# EAGLE design sx-lok-dec2-328 (EAGLE 7.5.0)
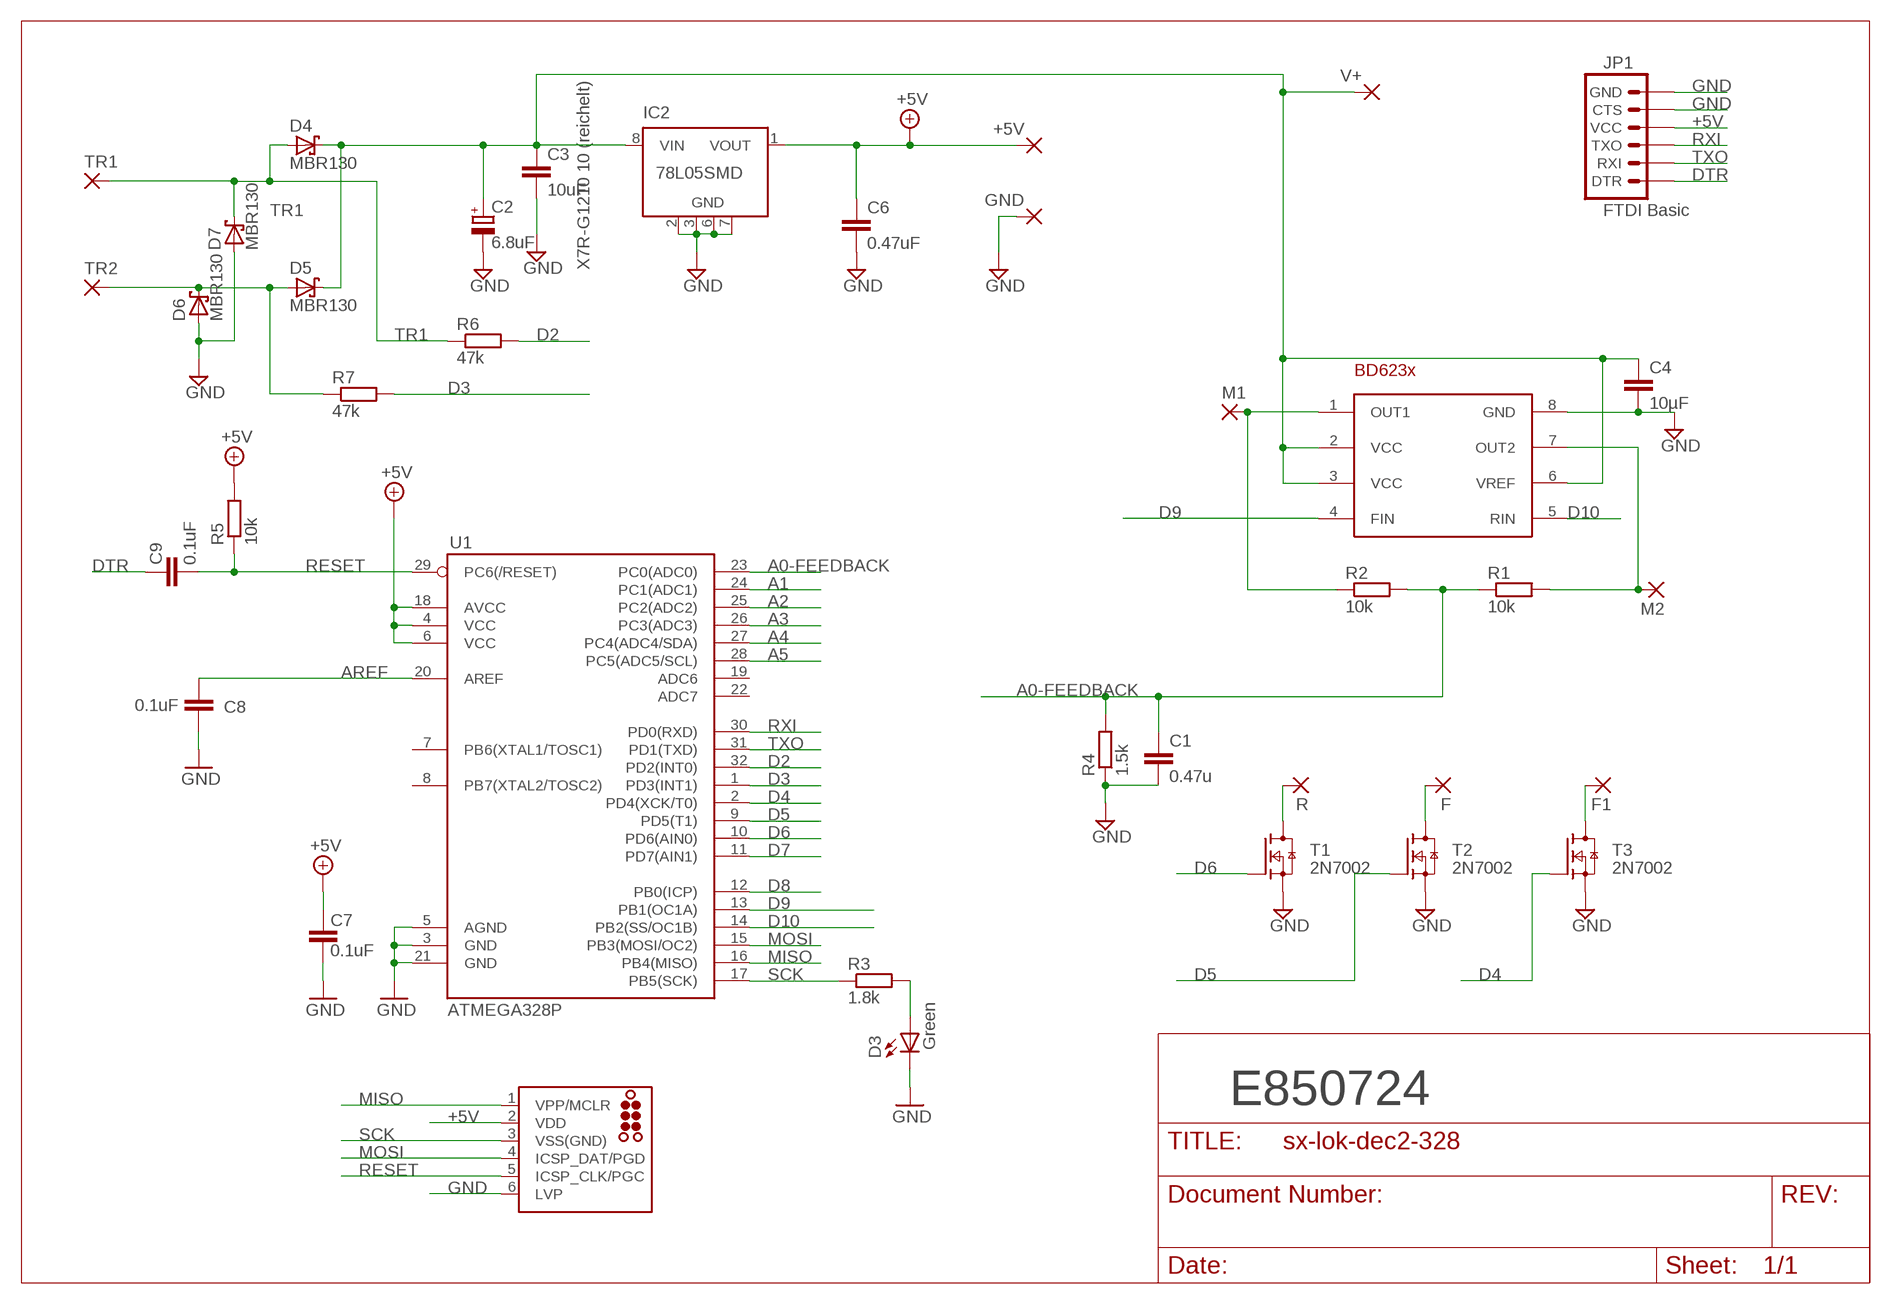
[diagram p0: schematic, sheet 1]

## Parts
+5V  SMD2  [SMD1,27-2,54]
BD6231  BD6231F  [SOP8]
C1  0.47u  C-EUC1206  [C1206]
C2  6.8uF  CPOL-EUSMCD  [SMC_D]
C3  10uF  C-EUC0805K  [C0805K]
C4  10µF  C-EUC1210K  [C1210K]
C6  0.47uF  C-EUC1206  [C1206]
C7  0.1uF  CAP0805  [0805]
C8  0.1uF  CAP0805  [0805]
C9  0.1uF  CAP0805  [0805]
D3  Green  LED0603  [LED-0603]
D4  MBR130  BAS116H  [SOD123F]
D5  MBR130  BAS116H  [SOD123F]
D6  MBR130  BAS116H  [SOD123F]
D7  MBR130  BAS116H  [SOD123F]
F  SMD2  [SMD1,27-2,54]
F1  SMD2  [SMD1,27-2,54]
GND  SMD2  [SMD1,27-2,54]
IC2  78L05SMD  [SO08]
J1  ISP  TC2030-MCP-NL  [TC2030-MCP-NL]
JP1  FTDI Basic  ARDUINO_SERIAL_PROGRAMPTH  [1X06]
M1  SMD2  [SMD1,27-2,54]
M2  SMD2  [SMD1,27-2,54]
R  SMD2  [SMD1,27-2,54]
R1  10k  R-EU_R0805  [R0805]
R2  10k  R-EU_R0805  [R0805]
R3  1.8k  R-EU_M0805  [M0805]
R4  1.5k  R-EU_R0805  [R0805]
R5  10k  R-EU_M0805  [M0805]
R6  47k  R-EU_R0805  [R0805]
R7  47k  R-EU_M0805  [M0805]
T1  2N7002  2N7002E  [SOT23]
T2  2N7002  2N7002E  [SOT23]
T3  2N7002  2N7002E  [SOT23]
TR1  SMD2  [SMD1,27-2,54]
TR2  SMD2  [SMD1,27-2,54]
U1  ATMEGA328P  ATMEGA168  [TQFP32-08]
V+  SMD2  [SMD1,27-2,54]

## Nets
+5V: +5V.1(P) C6.1 C7.2 IC2.1(VOUT) J1.2(VDD) JP1.4(VCC) R5.2 U1.4(VCC) U1.6(VCC) U1.18(AVCC)
+20V: BD6231.2(VCC) BD6231.3(VCC) BD6231.6(VREF) C2.+ C3.1 C4.1 D4.1(K) D5.1(K) IC2.8(VIN) V+.1(P)
A0-FEEDBACK: C1.1 R1.1 R2.2 R4.2 U1.23(PC0(ADC0))
A1: U1.24(PC1(ADC1))
A2: U1.25(PC2(ADC2))
A3: U1.26(PC3(ADC3))
A4: U1.27(PC4(ADC4/SDA))
A5: U1.28(PC5(ADC5/SCL))
AREF: C8.2 U1.20(AREF)
D2: R6.2 U1.32(PD2(INT0))
D3: R7.2 U1.1(PD3(INT1))
D4: T3.1(G) U1.2(PD4(XCK/T0))
D5: T2.1(G) U1.9(PD5(T1))
D6: T1.1(G) U1.10(PD6(AIN0))
D7: U1.11(PD7(AIN1))
D8: U1.12(PB0(ICP))
D9: BD6231.4(FIN) U1.13(PB1(OC1A))
D10: BD6231.5(RIN) U1.14(PB2(SS/OC1B))
DTR: C9.2 JP1.1(DTR)
GND: BD6231.8(GND) C1.2 C2.- C3.2 C4.2 C6.2 C7.1 C8.1 D3.C D6.2(A) D7.2(A) GND.1(P) IC2.2(GND) IC2.3(GND) IC2.6(GND) IC2.7(GND) J1.6(LVP) JP1.5(CTS) JP1.6(GND) R4.1 T1.2(S) T2.2(S) T3.2(S) U1.3(GND) U1.5(AGND) U1.21(GND)
MISO: J1.1(VPP/MCLR) U1.16(PB4(MISO))
MOSI: J1.4(ICSP_DAT/PGD) U1.15(PB3(MOSI/OC2))
MOTOR1: BD6231.1(OUT1) M1.1(P) R2.1
MOTOR2: BD6231.7(OUT2) M2.1(P) R1.2
N$1: D3.A R3.2
N$2: R.1(P) T1.3(D)
N$3: F.1(P) T2.3(D)
N$4: F1.1(P) T3.3(D)
RESET: C9.1 J1.5(ICSP_CLK/PGC) R5.1 U1.29(PC6(/RESET))
RXI: JP1.3(TXO) U1.30(PD0(RXD))
SCK: J1.3(VSS(GND)) R3.1 U1.17(PB5(SCK))
TR1: D4.2(A) D7.1(K) R6.1 TR1.1(P)
TR-L1: D5.2(A) D6.1(K) R7.1 TR2.1(P)
TXO: JP1.2(RXI) U1.31(PD1(TXD))
Unconnected: IC2.4(NC) IC2.5(NC) U1.7(PB6(XTAL1/TOSC1)) U1.8(PB7(XTAL2/TOSC2)) U1.19(ADC6) U1.22(ADC7)

## Notes on the sheet
- X7R-G1210 10 (reichelt)
- E850724

## Library data of the parts
+5V F F1 GND M1 M2 R TR1 TR2 V+ = wirepad:SMD2: SMD PAD
BD6231 = bd6231f:BD6231F: H-Bridge Driver - Rohm - BD622x and BD623x
C1 C3 C4 C6 = rcl:C-EU: CAPACITOR, European symbol
C2 = rcl:CPOL-EU: POLARIZED CAPACITOR, European symbol
C7-C9 = SparkFun:CAP: Capacitor Standard 0603 ceramic capacitor, and 0.1" leaded capacitor.
D3 = SparkFun:LED: LEDs Standard schematic elements and footprints for 5mm, 3mm, 1206, and 0603 sized LEDs. 5mm - Spark Fun Electronics SKU : COM-00529 (and others)
D4-D7 = NXP_60_26022015:BAS116H: Low leakage switching diode Low leakage switching diode, encapsulated in a SOD123F small and flat lead Surface-Mounted Device (SMD) plastic package. AAL Eindhoven MK
IC2 = linear:78L*SMD: Positive VOLTAGE REGULATOR
J1 = tag-connect:TC2030: TAG-CONNECT ICSP Connector Manufacturer: Tag-Connect <http://www.tag-connect.com> Cable for easy In-Circuit Serial Programming. Designed for Microchip ICD2, suitable for many others. Two variants - one "with legs" (for hands-free fit on PCB) and another "without legs" for quick programming. PAD Description 1 MCLR/Vpp 2 Vdd 3 GND 4 PGD (ISPDAT) 5 PGC (ISPCLK) 6 nc (used for LVP) ©2009 ROFA.cz - modified and updated by Robert Darlington ‹rdarlington@gmail.com›
JP1 = SparkFun:ARDUINO_SERIAL_PROGRAM
R1-R7 = rcl:R-EU_: RESISTOR, European symbol
T1-T3 = NXP_60_26022015:2N7002: N-channel TrenchMOS FET N-channel enhancement mode Field-Effect Transistor (FET) in a plastic package using TrenchMOS technology. AAL Eindhoven MK
U1 = SparkFun:ATMEGA168

## Net classes
0 default: width 0.203 mm
1 vcc: width 0.254 mm

## Board
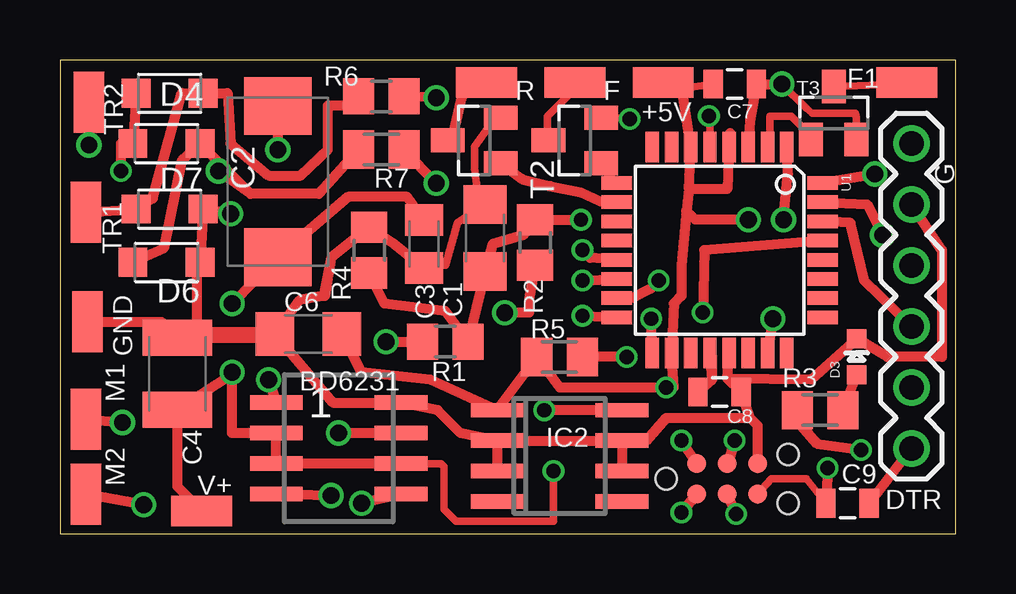
[diagram p1: board, top side]
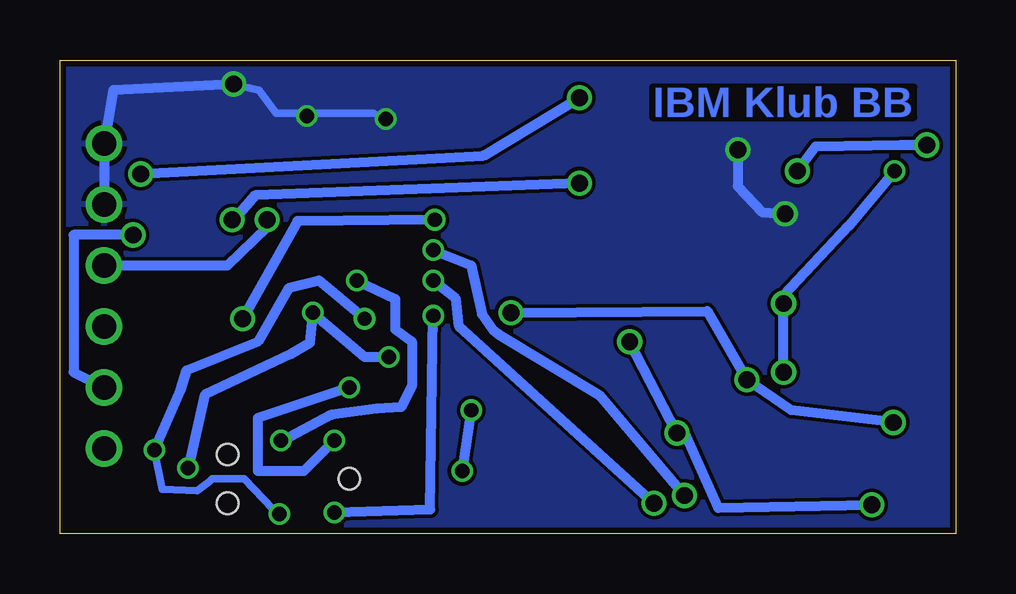
[diagram p2: board, bottom side, seen from below]

Size 37.34 x 19.74 mm. Coordinates in mm from the lower left corner, seen from the top.
Outline: 0,0 37.34,0 37.34,19.74 0,19.74 0,0
Copper layers (1*16): Top 0.018mm / dielectric 1.55mm / Bottom 0.018mm
Design rules "eC_2Layer_PClass6_BaseCopperO18_eCDefault": minimum track width 0.15mm, minimum drill 0.35mm, track to track 0.15mm, track to pad 0.15mm, pad to pad 0.15mm, via to via 0.15mm, smd to smd 0mil, copper to edge 0.25mm, drill to drill 0.35mm, minimum pad ring 0.175mm, minimum via ring 0.125mm, stop-mask expansion 0mil, vias tented up to drill 0.45mm, thermal gap 0.2mm

### Footprints (pad centres in the part's own frame; a part is rotated, then mirrored left to right if it is on the bottom)
SMD1,27-2,54 = smd 1.27 x 2.54: 1 0,0
SOP8 = smd 0.6 x 2.2: 1 -1.905,-2.6; 2 -0.635,-2.6; 3 0.635,-2.6; 4 1.905,-2.6; 5 1.905,2.6; 6 0.635,2.6; 7 -0.635,2.6; 8 -1.905,2.6
C1206 = smd 1.6 x 1.8: 1 -1.4,0; 2 1.4,0
SMC_D = smd 2.4 x 2.8: + -3.15,0; - 3.15,0
C0805K = smd 1.3 x 1.6: 1 -1,0; 2 1,0
C1210K = smd 1.5 x 2.9: 1 -1.5,0; 2 1.5,0
0805 = smd 0.8 x 1.2: 1 -0.9,0; 2 0.9,0
LED-0603 = smd 0.8 x 0.8: A 0,-0.75; C 0,0.75
SOD123F = smd 1.2 x 1.2: 1 -1.4,0; 2 1.4,0
SO08 = smd 0.6 x 2.2: 1 -1.905,-2.6; 2 -0.635,-2.6; 3 0.635,-2.6; 4 1.905,-2.6; 5 1.905,2.6; 6 0.635,2.6; 7 -0.635,2.6; 8 -1.905,2.6
TC2030-MCP-NL = smd 0.787 x 0.787: 1 1.27,-0.635; 2 1.27,0.635; 3 2.54,-0.635; 4 2.54,0.635; 5 3.81,-0.635; 6 3.81,0.635 | hole 0.889: 0,0; 5.08,-1.016; 5.08,1.016
1X06 = drill 1.016: 1 0,0; 2 2.54,0; 3 5.08,0; 4 7.62,0; 5 10.16,0; 6 12.7,0
R0805 = smd 1.3 x 1.5: 1 -0.95,0; 2 0.95,0
M0805 = smd 1.3 x 1.6: 1 -0.95,0; 2 0.95,0
SOT23 = smd 1 x 1.4: 1 -0.95,-1.1; 2 0.95,-1.1; 3 0,1.1
TQFP32-08 = smd 1.27 x 0.559: 1 -4.293,2.8; 2 -4.293,2; 3 -4.293,1.2; 4 -4.293,0.4; 5 -4.293,-0.4; 6 -4.293,-1.2; 7 -4.293,-2; 8 -4.293,-2.8; 17 4.293,-2.8; 18 4.293,-2; 19 4.293,-1.2; 20 4.293,-0.4; 21 4.293,0.4; 22 4.293,1.2; 23 4.293,2; 24 4.293,2.8 | smd 0.559 x 1.27: 9 -2.8,-4.293; 10 -2,-4.293; 11 -1.2,-4.293; 12 -0.4,-4.293; 13 0.4,-4.293; 14 1.2,-4.293; 15 2,-4.293; 16 2.8,-4.293; 25 2.8,4.293; 26 2,4.293; 27 1.2,4.293; 28 0.4,4.293; 29 -0.4,4.293; 30 -1.2,4.293; 31 -2,4.293; 32 -2.8,4.293

### Placement (x,y rotation side)
+5V  25.15,18.8 90 top
BD6231  11.62,3.56 270 top
C1  17.72,12.32 90 top
C2  9.08,14.67 90 top
C3  15.18,12.06 270 top
C4  4.89,6.67 90 top
C6  10.35,8.32 180 top
C7  28.13,18.73 180 top
C8  27.5,5.91 180 top
C9  32.83,1.27 0 top
D3  33.21,7.37 0 top
D4  4.57,18.35 0 top
D5  4.45,16.26 0 top
D6  4.45,11.3 0 top
D7  4.57,13.53 0 top
F  21.46,18.8 90 top
F1  35.31,18.8 90 top
GND  1.14,8.83 180 top
IC2  20.83,3.24 270 top
J1  25.27,2.29 0 top
JP1  35.5,3.56 90 top
M1  1.08,4.76 0 top
M2  1.08,1.65 0 top
R  17.78,18.8 90 top
R1  16.07,8 180 top
R2  19.81,12.13 90 top
R3  31.69,5.14 0 top
R4  12.89,11.81 270 top
R5  20.83,7.37 180 top
R6  13.4,18.22 0 top
R7  13.4,16 0 top
T1  17.27,16.38 90 top
T2  21.46,16.38 90 top
T3  32.26,17.53 0 top
TR1  1.08,13.4 180 top
TR2  1.21,17.97 180 top
U1  27.5,11.81 270 top
V+  5.91,0.95 270 top

### Tracks (layer width: path | path; a pad name or v marks a point on that pad's centre or on a via)
+5V  (via drill 0.6, 0.7)
  Top 0.305: C7.2 26.29,18.61 25.97,18.29
  Top 0.406: 26.23,14.35 27.81,14.35 U1.4 27.81,16.1 27.94,16.7 | 26.23,14.35 U1.6 25.97,18.29 +5V.1 | 26.23,14.35 26.11,13.45 | 26.11,13.45 25.91,11.18 25.91,9.91 25.59,9.59 U1.18 25.59,6.1 v25.27,6.1 20.83,6.1 R5.2 IC2.1 15.43,6.41 12.57,6.73 C6.1 | J1.2 v25.91,3.87 | v28.7,13.08 26.48,13.08 26.11,13.45
  Bottom 0.406: v25.91,3.87 27.18,2.6 29.08,2.6 29.08,4.83 v25.27,6.1 | JP1.4 30.35,11.18 28.7,12.76 v28.7,13.08
+20V  (via drill 0.6, 0.7)
  Top 0.305: BD6231.6 15.88,2.92 16,2.79 16,1.02 16.51,0.51 20.57,0.51 v20.57,2.6
  Top 0.406: C3.1 14.48,14.03 12,14.03 C2.+ v7.18,9.59 | BD6231.6 BD6231.3 BD6231.2 7.18,4.19 v7.18,6.73 7.18,6.64 C4.1 4.89,1.97 V+.1 | IC2.8 v20.19,5.14 | D4.1 D5.1 2.54,16.26 v2.54,15.11
  Bottom 0.406: v7.18,6.73 v7.18,9.59 7.18,9.91 4.45,12.83 v2.54,15.11 | v20.19,5.14 v20.57,2.6
A0-FEEDBACK  (via drill 0.6, 0.7)
  Top 0.406: R4.2 13.53,9.59 16.07,9.27 R1.1 C1.1 18.03,12.06 19.3,12.44 R2.2 v21.72,13.08 | v29.72,8.95 U1.23
  Bottom 0.406: v21.72,13.08 27.43,13.02 v29.72,8.95
AREF
  Top 0.406: U1.20 27.18,6.41 | 27.18,7.37 27.18,6.41 | 27.18,6.41 C8.2
D2  (via drill 0.7)
  Top 0.406: U1.32 v33.97,14.99 | v15.68,18.16 R6.2
  Bottom 0.406: v33.97,14.99 19.68,15.75 v15.68,18.16
D3  (via drill 0.7)
  Top 0.406: R7.2 v15.68,14.61 | v30.16,13.08 30.35,14.99 U1.1
  Bottom 0.406: v15.68,14.61 29.21,14.1 29.97,13.21 v30.16,13.08
D4
  Top 0.305: T3.1 31.31,16.57 30.48,17.4 29.59,17.4 29.59,16.2 U1.2
D5
  Top 0.305: T2.1 22.56,15.25 U1.9
D6
  Top 0.406: T1.1 19.26,14.78 20.45,14.48 21.72,14.22 22.54,13.84 U1.10
D9  (via drill 0.6, 0.7)
  Top 0.406: U1.13 22.1,11.49 21.84,11.68 v21.78,11.81 | v11.3,1.59 BD6231.4
  Bottom 0.406: v21.78,11.81 20.19,11.18 19.75,9.14 19.3,8.51 19.05,8.32 14.86,5.78 v11.3,1.59
D10  (via drill 0.6, 0.7)
  Top 0.406: BD6231.5 v12.57,1.27 | v21.78,10.54 U1.14
  Bottom 0.406: v12.57,1.27 20.7,8.64 20.83,9.78 v21.78,10.54
DTR
  Top 0.406: JP1.1 C9.2
GND  (via drill 0.6, 0.7)
  Top 0.305: C3.2 16.07,11.18 16.57,12.95 C1.2 17.59,13.97 17.4,14.22 17.27,15.24 17.27,16.13 17.97,17.08 T1.2 | T2.2 23.18,17.33 v23.75,17.27 | U1.5 27.1,17.1 v27.05,17.4 | T3.2 33.21,17.34 33.15,17.53 31.37,17.53 31.12,17.72 v30.1,18.73
  Top 0.406: C6.2 11.37,5.46 BD6231.8 | 14.8,5.46 BD6231.8 | IC2.2 IC2.3 | IC2.2 IC2.7 | IC2.7 IC2.6 | IC2.7 24.45,3.87 25.27,4.83 28.77,4.83 | 28.77,4.83 C8.1 27.83,6.45 | 27.83,6.45 U1.21 | 28.77,4.83 29.08,4.51 J1.6 | JP1.5 36.77,11.81 36.77,7.37 34.48,7.37 D3.C 31.31,6.41 27.83,6.45 | U1.3 28.77,17.21 C7.1 v30.1,18.73 | C3.2 13.84,12.13 R4.1 11.3,11.49 | 11.3,11.49 10.99,9.91 9.97,9.72 | 9.97,9.72 C6.2 | C2.- v9.08,16 | v7.11,13.34 D7.2 D6.2 5.71,11.17 5.71,8.25 5.84,8.38 9.02,8.38 9.97,9.72 | IC2.2 16.7,4.19 15.75,5.14 BD6231.8 | GND.1 4.23,8.83 C4.2 8.8,8.17 C6.2 | 11.3,11.49 11.18,10.79 11.05,9.91 10.29,9.78 9.97,9.72
  Bottom 0.305: v23.75,17.27 24.26,17.53 27.05,17.53 | 27.05,17.53 28.33,17.53 29.03,18.48 v30.1,18.73 | v27.05,17.4 27.05,17.53
  Bottom 0.406: JP1.5 JP1.6 35.12,18.48 v30.1,18.73 | v9.08,16 9.08,14.48 8.07,13.4 v7.11,13.34
  pour Bottom: 0.06,19.68 37.27,19.68 37.4,0 0.06,0
MISO  (via drill 0.6)
  Top 0.406: J1.1 v25.91,0.89 | v21.78,9.08 U1.16
  Bottom 0.406: v25.91,0.89 21.91,1.02 v21.78,9.08
MOSI  (via drill 0.6)
  Top 0.406: U1.15 23.81,9.81 24.64,10.22 v24.96,10.54 | v28.13,3.87 J1.4
  Bottom 0.406: v24.96,10.54 23.37,9.78 23.37,8.51 22.67,8 22.67,6.16 23.11,5.27 24.13,5.21 26.04,4.95 28.07,3.87 v28.13,3.87
MOTOR1  (via drill 0.7)
  Top 0.406: M1.1 v2.6,4.64 | v8.7,6.41 BD6231.1 | R2.1 19.56,9.78 19.56,9.21 v18.54,9.21
  Bottom 0.406: v2.6,4.64 6.86,5.14 v8.7,6.41 10.35,9.27 v18.54,9.21
MOTOR2  (via drill 0.7)
  Top 0.406: BD6231.7 v11.62,4.19 | v13.59,8 R1.2 | v3.49,1.21 M2.1
  Bottom 0.406: v13.59,8 v11.62,4.19 11.24,4.06 9.91,1.08 v3.49,1.21
N$1
  Top 0.406: R3.2 D3.A
N$2
  Top 0.406: R.1 18.71,18.8 16.76,18.29 16.26,16.13 T1.3
N$3
  Top 0.305: F.1 21.46,18.54 20.32,17.4 20.32,16.43 T2.3
N$4
  Top 0.305: T3.3 35.22,18.75 F1.1
RESET  (via drill 0.6)
  Top 0.305: C9.1 31.12,2.29 29.65,2.29 J1.5
  Top 0.406: U1.29 26.86,11.81 v26.8,9.21 | v23.62,7.37 R5.1 | v32,2.73 C9.1
  Bottom 0.406: v23.62,7.37 24.64,7.37 v26.8,9.21 26.92,7.94 27.69,7.49 31.31,5.78 v32,2.73
RXI
  Top 0.406: JP1.3 33.53,10.54 32.96,12.95 U1.30
SCK  (via drill 0.6)
  Top 0.406: R3.1 30.35,5.14 31.56,3.75 v33.4,3.49 | v28.19,0.83 J1.3 | U1.17 v24.64,8.95
  Bottom 0.305: v33.4,3.49 33.08,1.84 31.62,1.78 31.12,2.16 30.99,2.29 29.65,2.29 28.45,1.02 v28.19,0.83
  Bottom 0.406: v24.64,8.95 26.54,10.54 27.81,10.22 29.08,8 32.07,6.79 32.32,5.97 v33.4,3.49
TR1
  Top 0.406: TR1.1 D7.1 3.87,13.97 5.08,18.35 D4.2 6.99,18.35 7.11,16.26 8.7,14.92 10.03,14.92 11.18,16 11.18,17.84 12.26,17.84 R6.1
TR-L1  (via drill 0.7)
  Top 0.406: R7.1 10.79,14.16 7.94,14.16 | 7.94,14.16 D5.2 5.08,15.56 4.32,11.87 D6.1 | TR2.1 v1.21,16.19 | v6.6,15.11 7.94,14.16
  Bottom 0.406: v1.21,16.19 2.29,16.19 5.84,16.13 v6.6,15.11
TXO  (via drill 0.7)
  Top 0.406: U1.31 33.66,13.72 v34.29,12.45
  Bottom 0.406: v34.29,12.45 36.77,12.45 36.77,6.73 JP1.2

### Text on the board
Bottom: IBM Klub BB
tNames: G | DTR